# Altium schematic sheet Microcontroller.SchDoc
size A4; Author: İlker Keser; Revision: V1.0; SheetNumber: 5; SheetTotal: 9; Page: 5; Page Total: 9; Project Code: 02050838; Template: A4
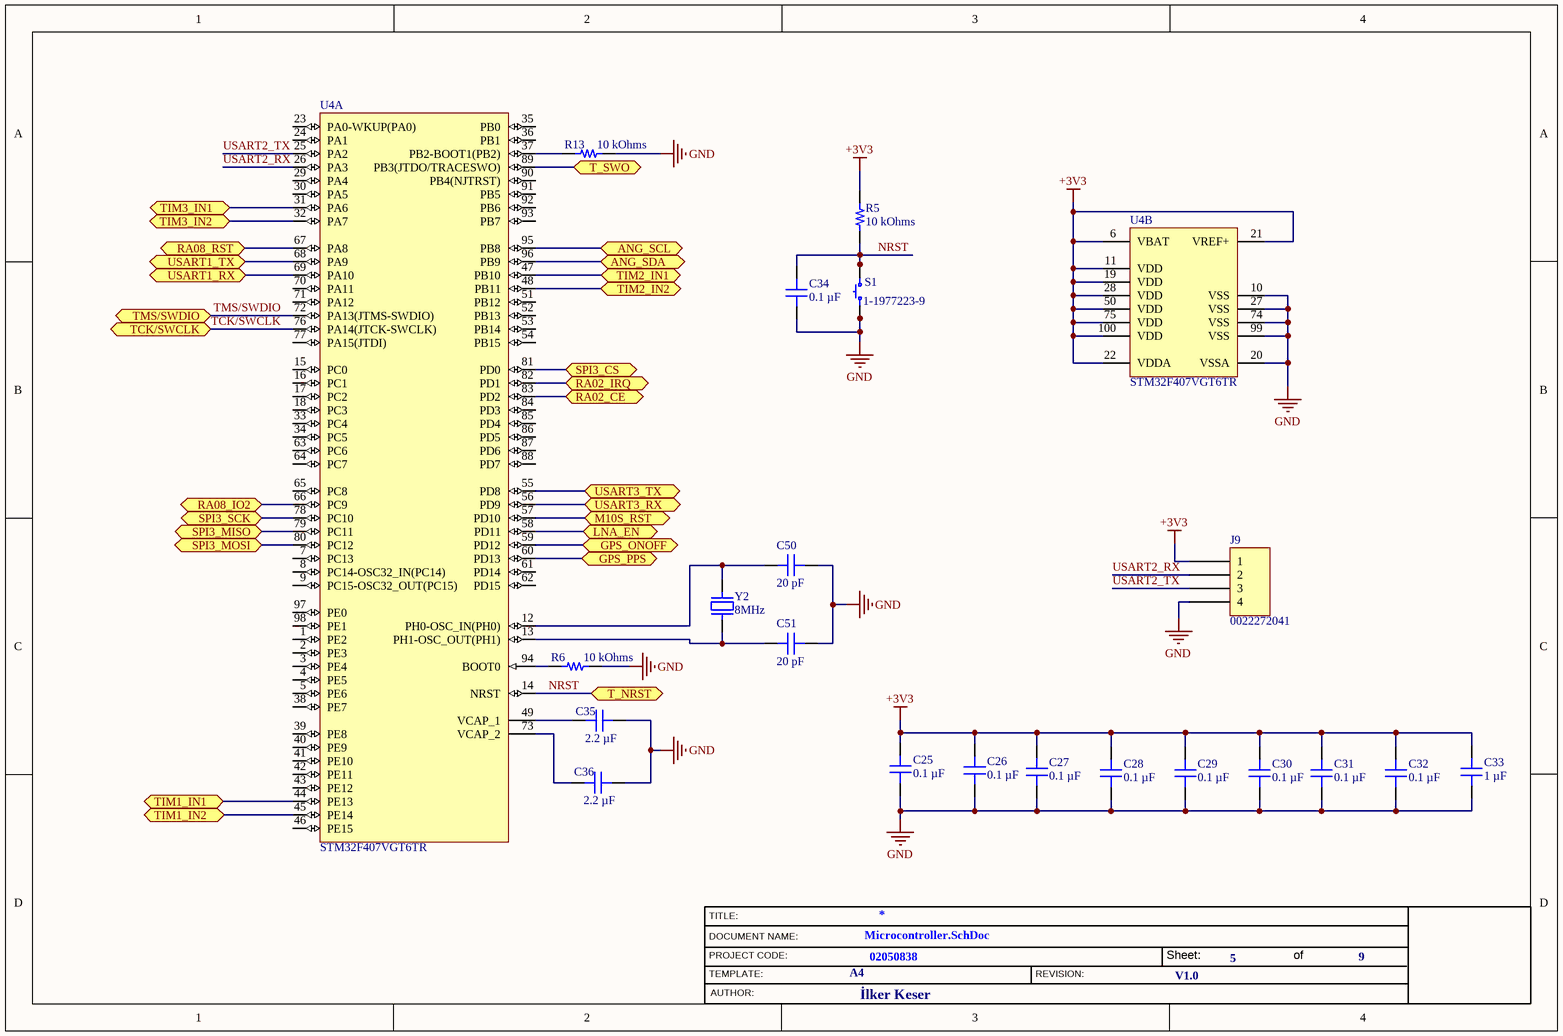
[diagram p0: Microcontroller.SchDoc]

## Parts
C25  0.1 µF  [CAP 0402_1005]
C26  0.1 µF  [CAP 0402_1005]
C27  0.1 µF  [CAP 0402_1005]
C28  0.1 µF  [CAP 0402_1005]
C29  0.1 µF  [CAP 0402_1005]
C30  0.1 µF  [CAP 0402_1005]
C31  0.1 µF  [CAP 0402_1005]
C32  0.1 µF  [CAP 0402_1005]
C33  1 µF  [CAP 0402_1005]
C34  0.1 µF  [CAP 0402_1005]
C35  2.2 µF  [CAP 0402_1005]
C36  2.2 µF  [CAP 0402_1005]
C50  20 pF  [CAP 0603_1608]
C51  20 pF  [CAP 0603_1608]
J9  0022272041  [MOLEX KK 0022272041]
R5  10 kOhms  [KOA RES RK73 RN73 0402_1005]
R6  10 kOhms  [YAGEO RES 0402_1005]
R13  10 kOhms  [YAGEO RES 0402_1005]
S1  1-1977223-9  [TE FSM6JSMA]
U4  STM32F407VGT6TR  [STM-LQFP100_N]  (parts A,B of 2)
Y2  8MHz  [TXC 9C]

## Ports
ANG_SCL (bidir, see Angular_Encoder[2B]), ANG_SDA (bidir, see Angular_Encoder[2B]), GPS_ONOFF (bidir, see GPS_GNSS[2B]), GPS_PPS (bidir, see GPS_GNSS[4B]), LNA_EN (bidir, see GPS_GNSS[4B]), M10S_RST (bidir, see GPS_GNSS[2B]), RA02_CE (bidir, see LoRa_Com[1C]), RA02_IRQ (bidir, see LoRa_Com[2C]), RA08_IO2 (bidir, see LoRa_Com[2B]), RA08_RST (bidir, see LoRa_Com[1B]), SPI3_CS (bidir, see LoRa_Com[1C]), SPI3_MISO (bidir, see LoRa_Com[1D]), SPI3_MOSI (bidir, see LoRa_Com[1D]), SPI3_SCK (bidir, see LoRa_Com[1C]), T_NRST (bidir, see Debugger[2D]), T_SWO (bidir, see Debugger[3C]), TCK/SWCLK (bidir, see Debugger[2B]), TIM1_IN1 (bidir, see Motor_Drivers[2B]), TIM1_IN2 (bidir, see Motor_Drivers[2B]), TIM2_IN1 (bidir, see Motor_Drivers[2A]), TIM2_IN2 (bidir, see Motor_Drivers[2A]), TIM3_IN1 (bidir, see Motor_Drivers[1C]), TIM3_IN2 (bidir, see Motor_Drivers[1C]), TMS/SWDIO (bidir, see Debugger[3C]), USART1_RX (bidir, see LoRa_Com[1B]), USART1_TX (bidir, see LoRa_Com[1B]), USART3_RX (bidir, see GPS_GNSS[4B]), USART3_TX (bidir, see GPS_GNSS[4B])

## Nets
+3V3: C25.2 C26.2 C27.2 C28.2 C29.2 C30.2 C31.2 C32.2 C33.2 J9.1 R5.1 U4.6(VBAT) U4.11(VDD) U4.19(VDD) U4.21(VREF+) U4.22(VDDA) U4.28(VDD) U4.50(VDD) U4.75(VDD) U4.100(VDD)
GND: C25.1 C26.1 C27.1 C28.1 C29.1 C30.1 C31.1 C32.1 C33.1 C34.1 C35.2 C36.2 C50.2 C51.2 J9.4 R6.2 R13.2 S1.1 S1.2 U4.10(VSS) U4.20(VSSA) U4.27(VSS) U4.74(VSS) U4.99(VSS)
ANG_SCL: U4.95(PB8) ; port ANG_SCL
ANG_SDA: U4.96(PB9) ; port ANG_SDA
GPS_ONOFF: U4.59(PD12) ; port GPS_ONOFF
GPS_PPS: U4.60(PD13) ; port GPS_PPS
LNA_EN: U4.58(PD11) ; port LNA_EN
M10S_RST: U4.57(PD10) ; port M10S_RST
NRST: C34.2 R5.2 S1.3 S1.4 U4.14(NRST) ; port T_NRST
RA02_CE: U4.83(PD2) ; port RA02_CE
RA02_IRQ: U4.82(PD1) ; port RA02_IRQ
RA08_IO2: U4.66(PC9) ; port RA08_IO2
RA08_RST: U4.67(PA8) ; port RA08_RST
SPI3_CS: U4.81(PD0) ; port SPI3_CS
SPI3_MISO: U4.79(PC11) ; port SPI3_MISO
SPI3_MOSI: U4.80(PC12) ; port SPI3_MOSI
SPI3_SCK: U4.78(PC10) ; port SPI3_SCK
T_SWO: U4.89(PB3(JTDO/TRACESWO)) ; port T_SWO
TCK/SWCLK: U4.76(PA14(JTCK-SWCLK)) ; port TCK/SWCLK
TIM1_IN1: U4.44(PE13) ; port TIM1_IN1
TIM1_IN2: U4.45(PE14) ; port TIM1_IN2
TIM2_IN1: U4.47(PB10) ; port TIM2_IN1
TIM2_IN2: U4.48(PB11) ; port TIM2_IN2
TIM3_IN1: U4.31(PA6) ; port TIM3_IN1
TIM3_IN2: U4.32(PA7) ; port TIM3_IN2
TMS/SWDIO: U4.72(PA13(JTMS-SWDIO)) ; port TMS/SWDIO
USART1_RX: U4.69(PA10) ; port USART1_RX
USART1_TX: U4.68(PA9) ; port USART1_TX
USART2_RX: J9.2 U4.26(PA3)
USART2_TX: J9.3 U4.25(PA2)
USART3_RX: U4.56(PD9) ; port USART3_RX
USART3_TX: U4.55(PD8) ; port USART3_TX
NetC35_1: C35.1 U4.49(VCAP_1)
NetC36_1: C36.1 U4.73(VCAP_2)
NetC50_1: C50.1 U4.12(PH0-OSC_IN(PH0)) Y2.2
NetC51_1: C51.1 U4.13(PH1-OSC_OUT(PH1)) Y2.1
NetR6_1: R6.1 U4.94(BOOT0)
NetR13_1: R13.1 U4.37(PB2-BOOT1(PB2))

Not connected (* = marked no-connect by the designer): U4 1(PE2) 2(PE3) 3(PE4) 4(PE5) 5(PE6) 7(PC13) 8(PC14-OSC32_IN(PC14)) 9(PC15-OSC32_OUT(PC15)) 15(PC0) 16(PC1) 17(PC2) 18(PC3) 23(PA0-WKUP(PA0)) 24(PA1) 29(PA4) 30(PA5) 33(PC4) 34(PC5) 35(PB0) 36(PB1) 38(PE7) 39(PE8) 40(PE9) 41(PE10) 42(PE11) 43(PE12) 46(PE15) 51(PB12) 52(PB13) 53(PB14) 54(PB15) 61(PD14) 62(PD15) 63(PC6) 64(PC7) 65(PC8) 70(PA11) 71(PA12) 77(PA15(JTDI)) 84(PD3) 85(PD4) 86(PD5) 87(PD6) 88(PD7) 90(PB4(NJTRST)) 91(PB5) 92(PB6) 93(PB7) 97(PE0) 98(PE1)

## Notes on the sheet
- TITLE:
- DOCUMENT NAME:
- PROJECT CODE:
- TEMPLATE:
- REVISION:
- Sheet:
- of
- AUTHOR:

## Library data of the parts
C25-C32 C34 = C0402C104M9PAC7867: CAP CER 0.1UF 6.3V X5R 0402; manufacturer: KEMET; Tolerance: ±20%; Part Number: C0402C104M9PAC7867; Capacitance: 0.1 µF; Applications: Bypass, Decoupling; componentlink1description: Datasheet; componentlink1url: https://api.kemet.com/component-edge/download/datasheet/C0402C104M9PACTU.pdf; componentlink2description: DigiKey Link; componentlink2url: https://www.digikey.com/en/products/detail/kemet/C0402C104M9PAC7867/2196244; Device Package: 0402 (1005 Metric); lastupdated: 9.02.2024 20:04:15; Lifecycle Status: Active; Minimum Order: 1; Mounting Type: Surface Mount, MLCC; Operating Temperature: -55°C ~ 85°C; Package / Case: 0402 (1005 Metric); packaging: CutTape; partid: 33676; Part Status: Active; price: 0.01; series: SMD Comm X5R; Size / Dimension: 0.039" L x 0.020" W (1.00mm x 0.50mm); Supplier 1: DigiKey; Supplier Part Number 1: 399-C0402C104M9PAC7867CT-ND; Temperature Coefficient: X5R; Thickness (Max): 0.022" (0.55mm); value: 0.1 µF; Voltage - Rated: 6.3V
C33 = GRM152R60J105ME15D: CAP CER 1UF 6.3V X5R 0402; manufacturer: Murata Electronics; Tolerance: ±20%; Part Number: GRM152R60J105ME15D; Capacitance: 1 µF; Applications: General Purpose; componentlink1description: Datasheet; componentlink1url: https://search.murata.co.jp/Ceramy/image/img/A01X/G101/ENG/GRM152R60J105ME15-01.pdf; componentlink2description: DigiKey Link; componentlink2url: https://www.digikey.com/en/products/detail/murata-electronics/GRM152R60J105ME15D/4904809; Device Package: 0402 (1005 Metric); lastupdated: 9.02.2024 20:04:33; Lifecycle Status: Active; Minimum Order: 1; Mounting Type: Surface Mount, MLCC; Operating Temperature: -55°C ~ 85°C; Package / Case: 0402 (1005 Metric); packaging: TapeAndReel; partid: 4147; Part Status: Active; price: 0.03; series: GRM; Size / Dimension: 0.039" L x 0.020" W (1.00mm x 0.50mm); Supplier 1: DigiKey; Supplier Part Number 1: 490-10006-1-ND; Temperature Coefficient: X5R; Thickness (Max): 0.009" (0.22mm); value: 1 µF; Voltage - Rated: 6.3V
C35 C36 = 885012105013: CAP CER 2.2UF 10V X5R 0402; manufacturer: Würth Elektronik; Tolerance: ±20%; Part Number: 885012105013; Capacitance: 2.2 µF; Applications: General Purpose; componentlink1description: Datasheet; componentlink1url: https://katalog.we-online.de/pbs/datasheet/885012105013.pdf; componentlink2description: DigiKey Link; componentlink2url: https://www.digikey.com/en/products/detail/würth-elektronik/885012105013/5453345; Device Package: 0402 (1005 Metric); lastupdated: 9.02.2024 20:04:19; Lifecycle Status: Active; Minimum Order: 1; Mounting Type: Surface Mount, MLCC; Operating Temperature: -55°C ~ 85°C; Package / Case: 0402 (1005 Metric); packaging: TapeAndReel; partid: 13152; Part Status: Active; price: 0.09; series: WCAP-CSGP; Size / Dimension: 0.039" L x 0.020" W (1.00mm x 0.50mm); Supplier 1: DigiKey; Supplier Part Number 1: 732-7490-1-ND; Temperature Coefficient: X5R; Thickness (Max): 0.022" (0.55mm); value: 2.2 µF; Voltage - Rated: 10V
C50 C51 = C0603C200G8HAC7867: CAP CER 20PF 10V X8R 0603; manufacturer: KEMET; Tolerance: ±2%; Part Number: C0603C200G8HAC7867; Capacitance: 20 pF; Applications: General Purpose; componentlink1description: Datasheet; componentlink1url: https://api.kemet.com/component-edge/download/datasheet/C0603C200G8HAC7867.pdf; componentlink2description: DigiKey Link; componentlink2url: https://www.digikey.com/en/products/detail/kemet/C0603C200G8HAC7867/7946222; Device Package: 0603 (1608 Metric); Features: Low ESL, High Temperature; lastupdated: 9.02.2024 20:09:59; Lifecycle Status: Active; Minimum Order: 1; Mounting Type: Surface Mount, MLCC; Operating Temperature: -55°C ~ 150°C; Package / Case: 0603 (1608 Metric); packaging: TapeAndReel; partid: 35714; Part Status: Active; price: 0.01; series: SMD Comm X8R HT150C; Size / Dimension: 0.063" L x 0.031" W (1.60mm x 0.80mm); Supplier 1: DigiKey; Supplier Part Number 1: 399-C0603C200G8HAC7867CT-ND; Temperature Coefficient: X8R; Thickness (Max): 0.034" (0.87mm); value: 20 pF; Voltage - Rated: 10V
J9 = 0022272041: CONN HEADER VERT 4POS 2.54MM; Manufacturer: Molex; Contact Length - Mating: 0.295" (7.49mm); Contact Length - Post: 0.140" (3.56mm); Material Flammability Rating: UL94 V-0; Number of Positions: 4; Number of Positions Loaded: All; Overall Contact Length: 0.560" (14.22mm); Pitch - Mating: 0.100" (2.54mm); Shrouding: Shrouded - 1 Wall; Style: Board to Cable/Wire; Part Number: 0022272041; ComponentLink1Description: Datasheet; ComponentLink1URL: https://www.molex.com/pdm_docs/sd/022272041_sd.pdf; ComponentLink2Description: DigiKey Link; ComponentLink2URL: http://digikey.com/product-detail/en/molex/0022272041/WM4113-ND/1130579; Connector Type: Header; Contact Finish - Mating: Tin; Contact Finish - Post: Tin; Contact Finish Thickness - Mating: 100.0µin (2.54µm); Contact Material: Brass; Contact Shape: Square; Contact Type: Male Pin; Fastening Type: Friction Lock; Insulation Color: Natural; Insulation Height: 0.461" (11.70mm); Insulation Material: Polyamide (PA), Nylon; LastUpdated: 12.01.2020 23:52:05; Lifecycle Status: Active; Minimum Order: 1; Mounting Type: Through Hole; Number of Rows: 1; Packaging: Bulk; PartId: 78; Part Status: Active; Price: 0.40; Series: KK 6410; Supplier 1: DigiKey; Supplier Part Number 1: WM4113-ND; Termination: Solder
R5 = RK73H1ETTP1002D: RES 10K OHM 0.5% 1/10W 0402; Manufacturer: KOA Speer Electronics, Inc.; Power (Watts): 0.1W, 1/10W; Temperature Coefficient: ±100ppm/°C; Part Number: RK73H1ETTP1002D; Value: 10 kOhms; ComponentLink1Description: Datasheet; ComponentLink1URL: http://www.koaspeer.com/catimages/Products/RK73H/RK73H.pdf; ComponentLink2Description: DigiKey Link; ComponentLink2URL: https://www.digikey.com/en/products/detail/koa-speer-electronics-inc/RK73H1ETTP1002D/9844692; Composition: Thick Film; Device Package: 0402 (1005 Metric); Features: Automotive AEC-Q200; Height - Seated (Max): 0.016" (0.40mm); LastUpdated: 25.07.2024 09:41:31; Lifecycle Status: Active; Minimum Order: 1; Number of Terminations: 2; Operating Temperature: -55°C ~ 155°C; Package / Case: 0402 (1005 Metric); Packaging: TapeAndReel; PartId: 14647; Part Status: Active; Price: 0.03; Ratings: AEC-Q200; Resistance: 10 kOhms; Series: RK73H; Size / Dimension: 0.039" L x 0.020" W (1.00mm x 0.50mm); Supplier 1: DigiKey; Supplier Part Number 1: 2019-RK73H1ETTP1002DCT-ND; Supplier Device Package: 0402; Tolerance: ±0.5%
R6 R13 = RP0402BRD0710KL: RES 10K OHM 0.1% 1/16W 0402; Manufacturer: Yageo; Power (Watts): 0.063W, 1/16W; Temperature Coefficient: ±25ppm/°C; Part Number: RP0402BRD0710KL; Value: 10 kOhms; ComponentLink1Description: Datasheet; ComponentLink1URL: https://www.yageo.com/upload/media/product/products/datasheet/rchip/PYu-RP_51_RoHS_L_0.pdf; ComponentLink2Description: DigiKey Link; ComponentLink2URL: https://www.digikey.com/en/products/detail/yageo/RP0402BRD0710KL/16916584; Composition: Thin Film; Device Package: 0402 (1005 Metric); Features: Anti-Sulfur, Automotive AEC-Q200, Moisture Resistant; Height - Seated (Max): 0.014" (0.35mm); LastUpdated: 25.07.2024 09:18:00; Lifecycle Status: Active; Minimum Order: 1; Number of Terminations: 2; Operating Temperature: -55°C ~ 155°C; Package / Case: 0402 (1005 Metric); Packaging: TapeAndReel; PartId: 70202; Part Status: Active; Price: 0.06; Resistance: 10 kOhms; Series: RP; Size / Dimension: 0.039" L x 0.020" W (1.00mm x 0.50mm); Supplier 1: DigiKey; Supplier Part Number 1: 13-RP0402BRD0710KLCT-ND; Supplier Device Package: 0402; Tolerance: ±0.1%
S1 = 1-1977223-9: SWITCH TACTILE SPST-NO 0.05A 24V; Manufacturer: TE Connectivity ALCOSWITCH Switches; Actuator Height off PCB, Vertical: 7.00mm; Actuator Orientation: Top Actuated; Actuator Type: Standard; Contact Rating @ Voltage: 0.05A @ 24VDC; Illumination: Non-Illuminated; Operating Force: 260gf; Outline: 6.00mm x 6.00mm; Switch Function: Off-Mom; Part Number: 1-1977223-9; Circuit: SPST-NO; ComponentLink1Description: Datasheet; ComponentLink1URL: https://www.te.com/commerce/DocumentDelivery/DDEController?Action=srchrtrv&DocNm=1308111-1_SWITCHES_CORE_PROGRAM_CATALOG&DocType=CS&DocLang=English; ComponentLink2Description: DigiKey Link; ComponentLink2URL: http://digikey.com/product-detail/en/te-connectivity-alcoswitch-switches/1-1977223-9/1-1977223-9-ND/5401299; LastUpdated: 3.06.2024 20:19:31; Lifecycle Status: Active; Minimum Order: 1500; Mounting Type: Surface Mount; Packaging: Bulk; Price: 0.36; Series: FSMJSMA; Supplier 1: DigiKey; Supplier Part Number 1: 1-1977223-9-ND; Termination Style: Gull Wing
U4 = STM32F407VGT6TR: ARM Cortex-M4 32-bit MCU+FPU, 210 DMIPS, 1024 kB Flash, 192 kB Internal RAM, 82 I/Os, 100-pin LQFP, -40 to 85 degC, Tape and Reel; Manufacturer: STMicroelectronics; D/A Converter: 2x12-bit; FLASH Size (Prog) (kB): 1024; I/Os (High Current): 82; Internal RAM Size (kB): 192; Operating Frequency(F) (Processor speed) (MHz): 168; Supply Voltage(Vcc) max (V): 3.6; Supply Voltage(Vcc) min (V): 1.8; DatasheetVersion: Rev. 4; PackageVersion: Rev. 1, 06/2013; PackageReference: LQFP100; PackageDescription: 100-Pin Low Profile Quad Flat Package, 14 x 14 mm Body, 0.5 mm Pitch; Supplier 1: Digi-Key; Supplier Part Number 1: STM32F407VGT6TR-ND; Supplier 2: Newark; Supplier Part Number 2: 99W9913; Supplier 3: Newark; Supplier Part Number 3: 43W6529; Supplier 4: Mouser; Supplier Part Number 4: 511-STM32F407VGT6TR; Core: ARM Cortex-M4; Packing: Tape and Reel; Mounting Technology: Surface Mount; PartNumber: STM32F407VGT6TR; ComponentLink1Description: Manufacturer URL; ComponentLink1URL: http://www.st.com/web/en/home.html; ComponentLink2Description: Datasheet; ComponentLink2URL: http://www.st.com/st-web-ui/static/active/en/resource/technical/document/datasheet/DM00037051.pdf; ComponentLink3Description: Package Specification; ComponentLink3URL: http://www.st.com/st-web-ui/static/active/en/resource/technical/document/data_brief/DM00071938.pdf
Y2 = 9C-8.000MBBK-T: CRYSTAL 8.0000MHZ 20PF SMD; Manufacturer: TXC CORPORATION; ESR (Equivalent Series Resistance): 80 Ohms; Frequency Stability: ±50ppm; Operating Mode: Fundamental; Part Number: 9C-8.000MBBK-T; ComponentLink1Description: Datasheet; ComponentLink1URL: http://www.txccorp.com/download/products/quartz_crystals/2015TXC_9C_32.pdf; ComponentLink2Description: DigiKey Link; ComponentLink2URL: http://digikey.com/product-detail/en/txc-corporation/9C-8.000MBBK-T/887-2475-1-ND/4475454; Frequency: 8MHz; Frequency Tolerance: ±50ppm; Height - Seated (Max): 0.161" (4.10mm); LastUpdated: 3.06.2024 20:02:24; Lifecycle Status: Active; Load Capacitance: 20pF; Minimum Order: 1; Mounting Type: Surface Mount; Operating Temperature: -20°C ~ 70°C; Package / Case: HC-49S; Packaging: TapeAndReel; PartId: 697; Part Status: Active; Price: 0.18; Series: 9C; Size / Dimension: 0.449" L x 0.189" W (11.40mm x 4.80mm); Supplier 1: DigiKey; Supplier Part Number 1: 887-2475-1-ND; Type: MHz Crystal; Value: 8MHz